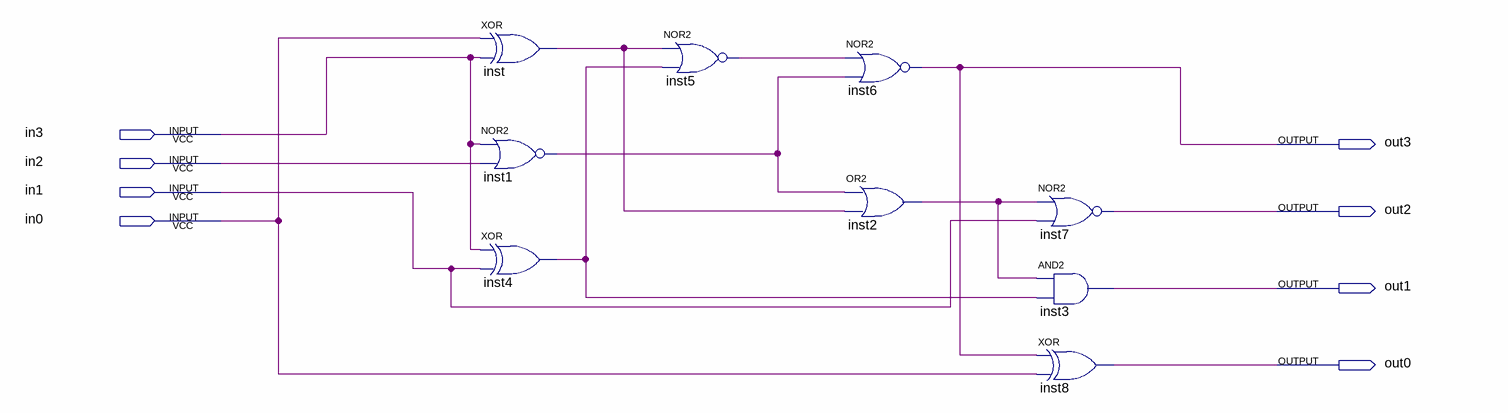
[diagram p0: schematic sheet]
// Quartus schematic Dabble.bdf as structural Verilog: 9 symbols, 8 pins
module Dabble (
  input  in3,
  input  in2,
  input  in1,
  input  in0,
  output out3,
  output out2,
  output out1,
  output out0
);

  wire inst1_out, inst2_out, inst4_out, inst5_out, inst_out;

  xor inst (inst_out, in0, in3);
  nor inst1 (inst1_out, in3, in2);
  xor inst4 (inst4_out, in3, in1);
  nor inst5 (inst5_out, inst_out, inst4_out);
  nor inst6 (out3, inst5_out, inst1_out);
  or inst2 (inst2_out, inst1_out, inst_out);
  nor inst7 (out2, inst2_out, in1);
  and inst3 (out1, inst2_out, inst4_out);
  xor inst8 (out0, out3, in0);
endmodule
